# EAGLE schematic PowerBoard (EAGLE 8.6.0)
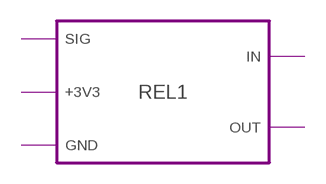
[diagram p0: schematic, sheet 1]

## Module instances
REL1 = RELAY

## Library data of the parts

## Module RELAY
Ports: SIG(in) +3V3(pwr) GND(pwr) IN(pwr) OUT(pwr)
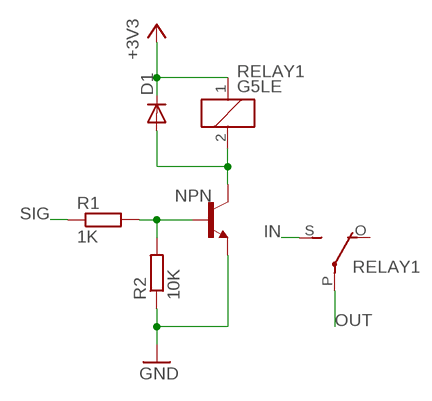
[diagram p1: schematic, module RELAY, sheet 1]

### Parts
D1  1N4446  [DO35-10]
NPN  -NPN-TO5  [TO5]
R1  1K  R-EU_R0805  [R0805]
R2  10K  R-EU_R0805  [R0805]
RELAY1  G5LE  [G5LE]

### Nets
+3V3: D1.C RELAY1.1
GND: NPN.1(E) R2.1
IN: RELAY1.S(2:S)
N$1: NPN.2(B) R1.2 R2.2
N$2: D1.A NPN.3(C) RELAY1.2
OUT: RELAY1.P(2:P)
SIG: R1.1
Unconnected: RELAY1.O(2:O)

### Library data of the parts
D1 = diode:1N4446: DIODE high speed (Philips)
NPN = transistor:*-NPN-: NPN Transistror BF959 corrected 2008.03.06
R1 R2 = rcl:R-EU_: RESISTOR, European symbol; SPICEPREFIX: R
RELAY1 = relay:G5LE: RELAY 1 x switch, 10 A/120 V AC, 8 A/30 V DC, Omron; OC_FARNELL: unknown; OC_NEWARK: unknown